# Altium project power-prj.PrjPcb
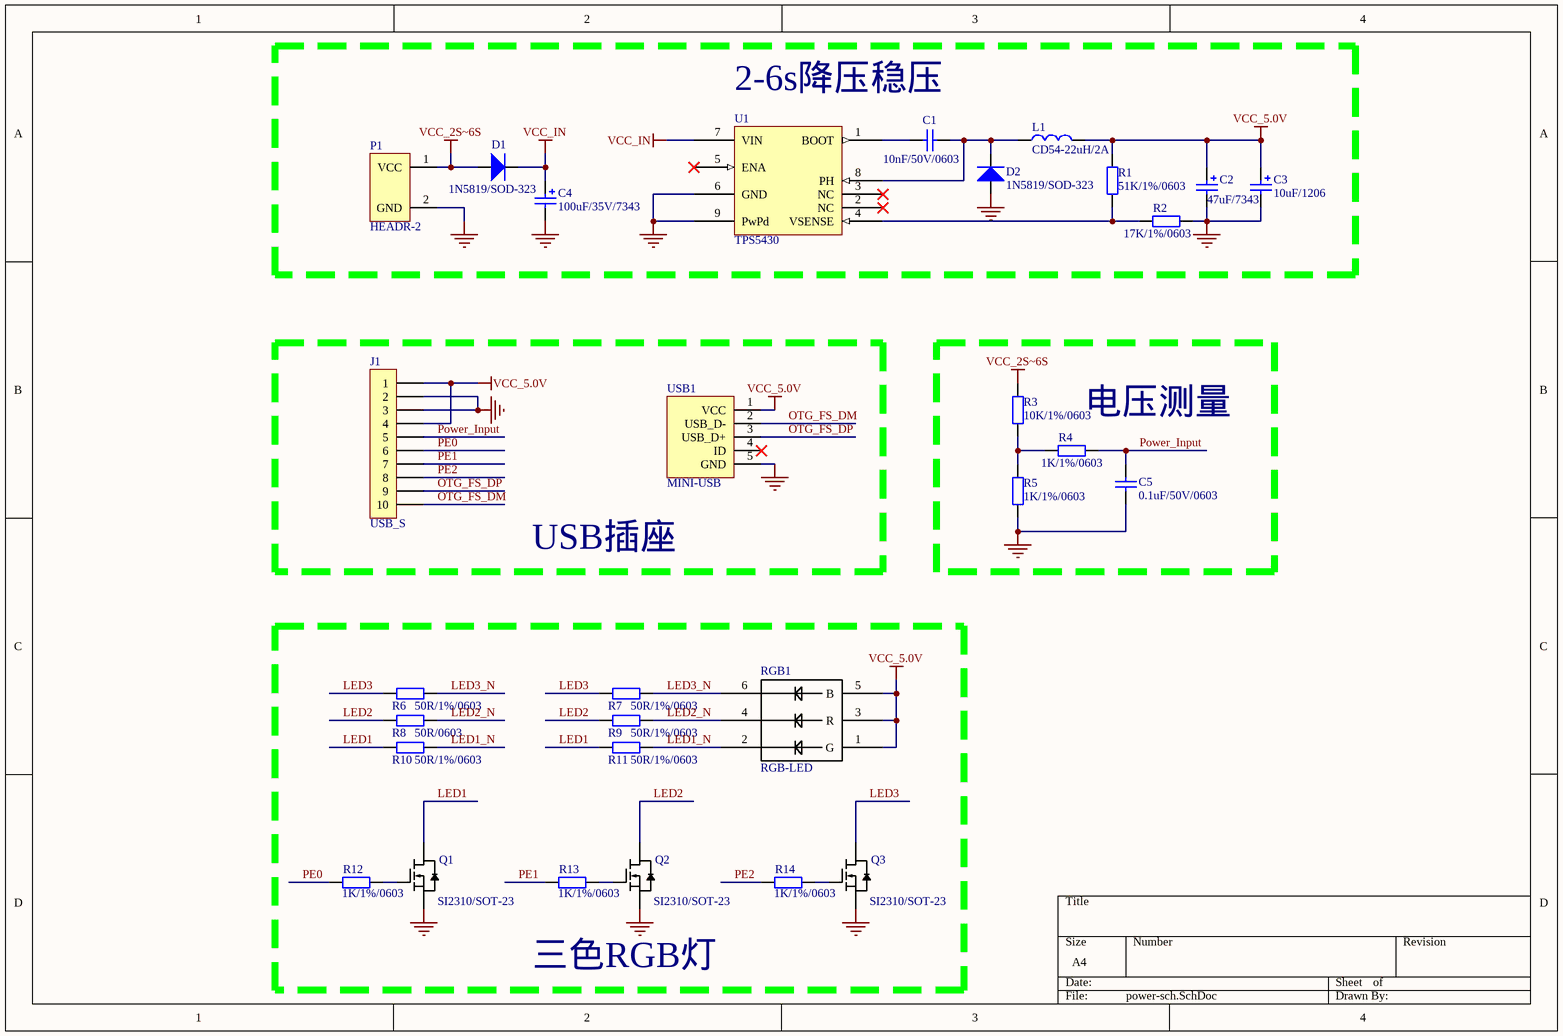
[diagram p0: power-sch.SchDoc]
1 sheet, 30 parts. Net scope: global (net labels, ports and power ports of the same name join across sheets).
Board file: PWR_PCB.PcbDoc

## Sheet power-sch.SchDoc
size A4

### Parts
C1  10nF/50V/0603  [LC-0603_C]
C2  47uF/7343  [LC-CASE-D_7343]
C3  10uF/1206  [LC-CASE-A_3216]
C4  100uF/35V/7343  [LC-CASE-D_7343]
C5  0.1uF/50V/0603  [LC-0603_C]
D1  1N5819/SOD-323  [SOD_323_F]
D2  1N5819/SOD-323  [SOD_323_F]
J1  USB_S  [SH 1.0-10P]
L1  CD54-22uH/2A  [L_SMD_10040]
P1  HEADR-2  [SH 1.0-2P]
Q1  SI2310/SOT-23  [LC-SOT-23(SOT-23-3)]
Q2  SI2310/SOT-23  [LC-SOT-23(SOT-23-3)]
Q3  SI2310/SOT-23  [LC-SOT-23(SOT-23-3)]
R1  51K/1%/0603  [LC-0603_R]
R2  17K/1%/0603  [LC-0603_R]
R3  10K/1%/0603  [LC-0603_R]
R4  1K/1%/0603  [LC-0603_R]
R5  1K/1%/0603  [LC-0603_R]
R6  50R/1%/0603  [LC-0603_R]
R7  50R/1%/0603  [LC-0603_R]
R8  50R/0603  [LC-0603_R]
R9  50R/1%/0603  [LC-0603_R]
R10  50R/1%/0603  [LC-0603_R]
R11  50R/1%/0603  [LC-0603_R]
R12  1K/1%/0603  [LC-0603_R]
R13  1K/1%/0603  [LC-0603_R]
R14  1K/1%/0603  [LC-0603_R]
RGB1  RGB-LED  [RGB-5050]
U1  TPS5430  [SOIC_8_PAD]
USB1  MINI-USB  [mini_usb_AB]

### Blocks framed on the sheet
2-6s降压稳压: C1-C4 D1 D2 L1 P1 R1 R2 U1
USB插座: J1 USB1
电压测量: C5 R3-R5
三色RGB灯: Q1-Q3 R6-R14 RGB1

### Nets
GND: C2.2 C3.2 C4.2 C5.1 D2.1 J1.2 J1.3 P1.2(GND) Q1.2(SOURCE) Q2.2(SOURCE) Q3.2(SOURCE) R2.1 R5.1 U1.6(GND) U1.9(PwPd) USB1.5(GND)
VCC_2S~6S: D1.1 P1.1(VCC) R3.2
VCC_5.0V: C2.1 C3.1 J1.1 J1.4 L1.2 R1.2 RGB1.1(G) RGB1.3(R) RGB1.5(B) USB1.1(VCC)
VCC_IN: C4.1 D1.2 U1.7(VIN)
LED1: Q1.3(DRAIN) R10.1 R11.1
LED1_N: R10.2 R11.2 RGB1.2
LED2: Q2.3(DRAIN) R8.1 R9.1
LED2_N: R8.2 R9.2 RGB1.4
LED3: Q3.3(DRAIN) R6.1 R7.1
LED3_N: R6.2 R7.2 RGB1.6
OTG_FS_DM: J1.10 USB1.2(USB_D-)
OTG_FS_DP: J1.9 USB1.3(USB_D+)
PE0: J1.6 R12.1
PE1: J1.7 R13.1
PE2: J1.8 R14.1
Power_Input: C5.2 J1.5 R4.1
NetC1_1: C1.1 U1.1(BOOT)
NetC1_2: C1.2 D2.2 L1.1 U1.8(PH)
NetQ1_1: Q1.1(GATE) R12.2
NetQ2_1: Q2.1(GATE) R13.2
NetQ3_1: Q3.1(GATE) R14.2
NetR1_1: R1.1 R2.2 U1.4(VSENSE)
NetR3_1: R3.1 R4.2 R5.2

Not connected (* = marked no-connect by the designer): U1 2(NC)* 3(NC)* 5(ENA)*; USB1 4(ID)*

### Library data of the parts
C1 C5 = Cap: Capacitor; Published: 8-Jun-2000; LatestRevisionDate: 17-Jul-2002; LatestRevisionNote: Re-released for DXP Platform.; PackageReference: RAD-0.3; Publisher: Altium Limited; PackageDescription: Radial Cap, Thru-Hole; 2 Leads; 0.3 in Pin Spacing
  C1: Value: 10nF/50V/0603
  C5: Value: 0.1uF/50V/0603
C2-C4 = Cap Pol2: Polarized Capacitor (Axial); Published: 8-Jun-2000; LatestRevisionDate: 17-Jul-2002; LatestRevisionNote: Re-released for DXP Platform.; PackageReference: POLAR0.8; Publisher: Altium Limited; PackageDescription: Polarized Capacitor; 2 Leads
  C2: Value: 47uF/7343
  C3: Value: 10uF/1206
  C4: Value: 100uF/35V/7343
D1 D2 = 1N5819
P1 = HEADER-PWR
Q1-Q3 = SI2310
R1-R14 = Res2: Resistor; Published: 8-Jun-2000; LatestRevisionDate: 17-Jul-2002; LatestRevisionNote: Re-released for DXP Platform.; PackageReference: AXIAL-0.4; Publisher: Altium Limited; PackageDescription: Axial Device, Thru-Hole; 2 Leads; 0.4 in Pin Spacing
  R1: Value: 51K/1%/0603
  R2: Value: 17K/1%/0603
  R3: Value: 10K/1%/0603
  R4 R5 R12-R14: Value: 1K/1%/0603
  R6 R7 R9-R11: Value: 50R/1%/0603
  R8: Value: 50R/0603
RGB1 = RGB-5050